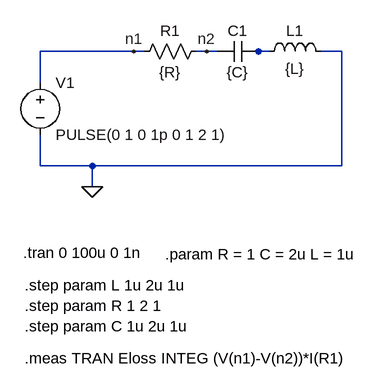
[diagram p0: schematic basic_RLC.asc]
basic_RLC.asc, the LTspice schematic file:
Version 4
SHEET 1 880 680
WIRE 64 144 -80 144
WIRE 80 144 64 144
WIRE 176 144 160 144
WIRE 192 144 176 144
WIRE 256 144 240 144
WIRE 272 144 256 144
WIRE 384 144 352 144
WIRE -80 192 -80 144
WIRE -80 320 -80 272
WIRE 0 320 -80 320
WIRE 384 320 384 144
WIRE 384 320 0 320
WIRE 0 352 0 320
FLAG 0 352 0
FLAG 64 144 n1
FLAG 176 144 n2
SYMBOL res 176 128 R90
WINDOW 0 0 56 VBottom 2
WINDOW 3 32 56 VTop 2
SYMATTR InstName R1
SYMATTR Value {R}
SYMBOL cap 192 160 R270
WINDOW 0 32 32 VTop 2
WINDOW 3 0 32 VBottom 2
SYMATTR InstName C1
SYMATTR Value {C}
SYMBOL ind 256 160 R270
WINDOW 0 32 56 VTop 2
WINDOW 3 5 56 VBottom 2
SYMATTR InstName L1
SYMATTR Value {L}
SYMBOL voltage -80 176 R0
WINDOW 123 0 0 Left 2
WINDOW 39 0 0 Left 2
SYMATTR InstName V1
SYMATTR Value PULSE(0 1 0 1p 0 1 2 1)
TEXT -106 454 Left 2 !.tran 0 100u 0 1n
TEXT 112 456 Left 2 !.param R = 1 C = 2u L = 1u
TEXT -104 504 Left 2 !.step param L 1u 2u 1u\n.step param R 1 2 1\n.step param C 1u 2u 1u
TEXT -104 616 Left 2 !.meas TRAN Eloss INTEG (V(n1)-V(n2))*I(R1)

The netlist it stands for:
* basic_RLC.asc
R1 n2 n1 {R}
C1 n2 N001 {C}
L1 N001 0 {L}
V1 n1 0 PULSE(0 1 0 1p 0 1 2 1)
.tran 0 100u 0 1n
.param R = 1 C = 2u L = 1u
.step param L 1u 2u 1u
.step param R 1 2 1
.step param C 1u 2u 1u
.meas TRAN Eloss INTEG (V(n1)-V(n2))*I(R1)
.backanno
.end